# EasyEDA Pro project novadac.eprj, board PCB5
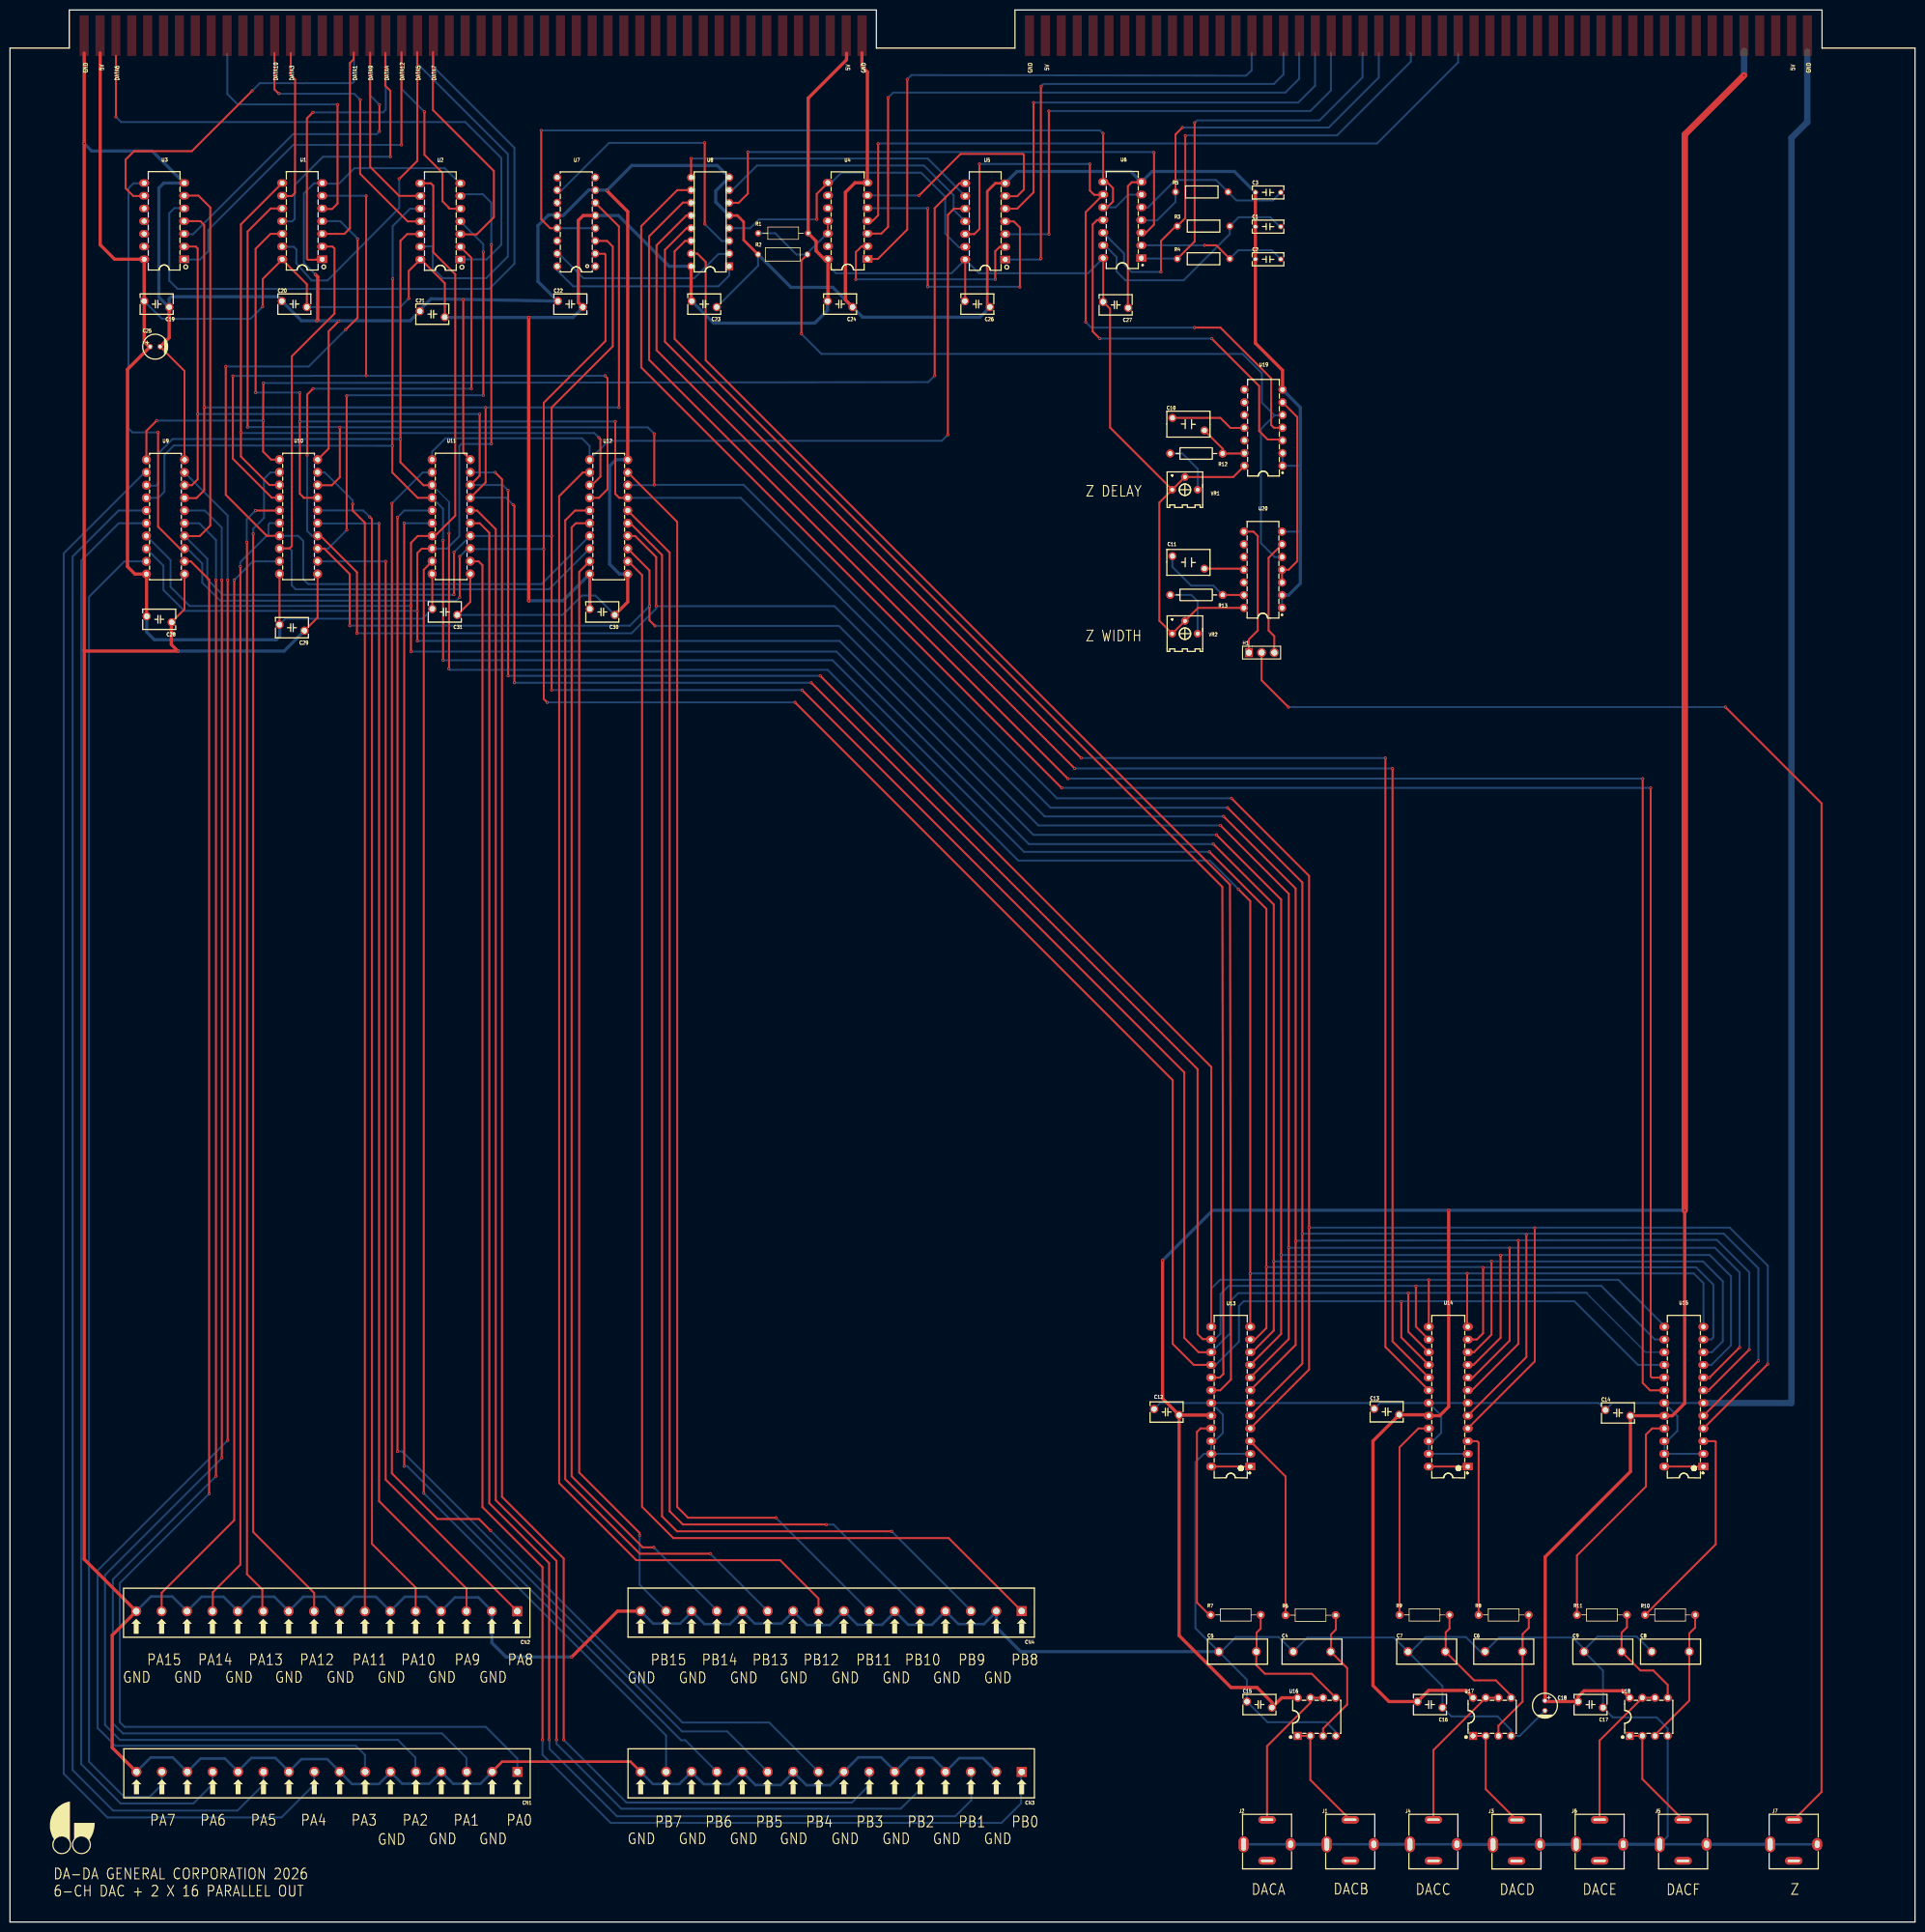
[diagram p3: board, top side]
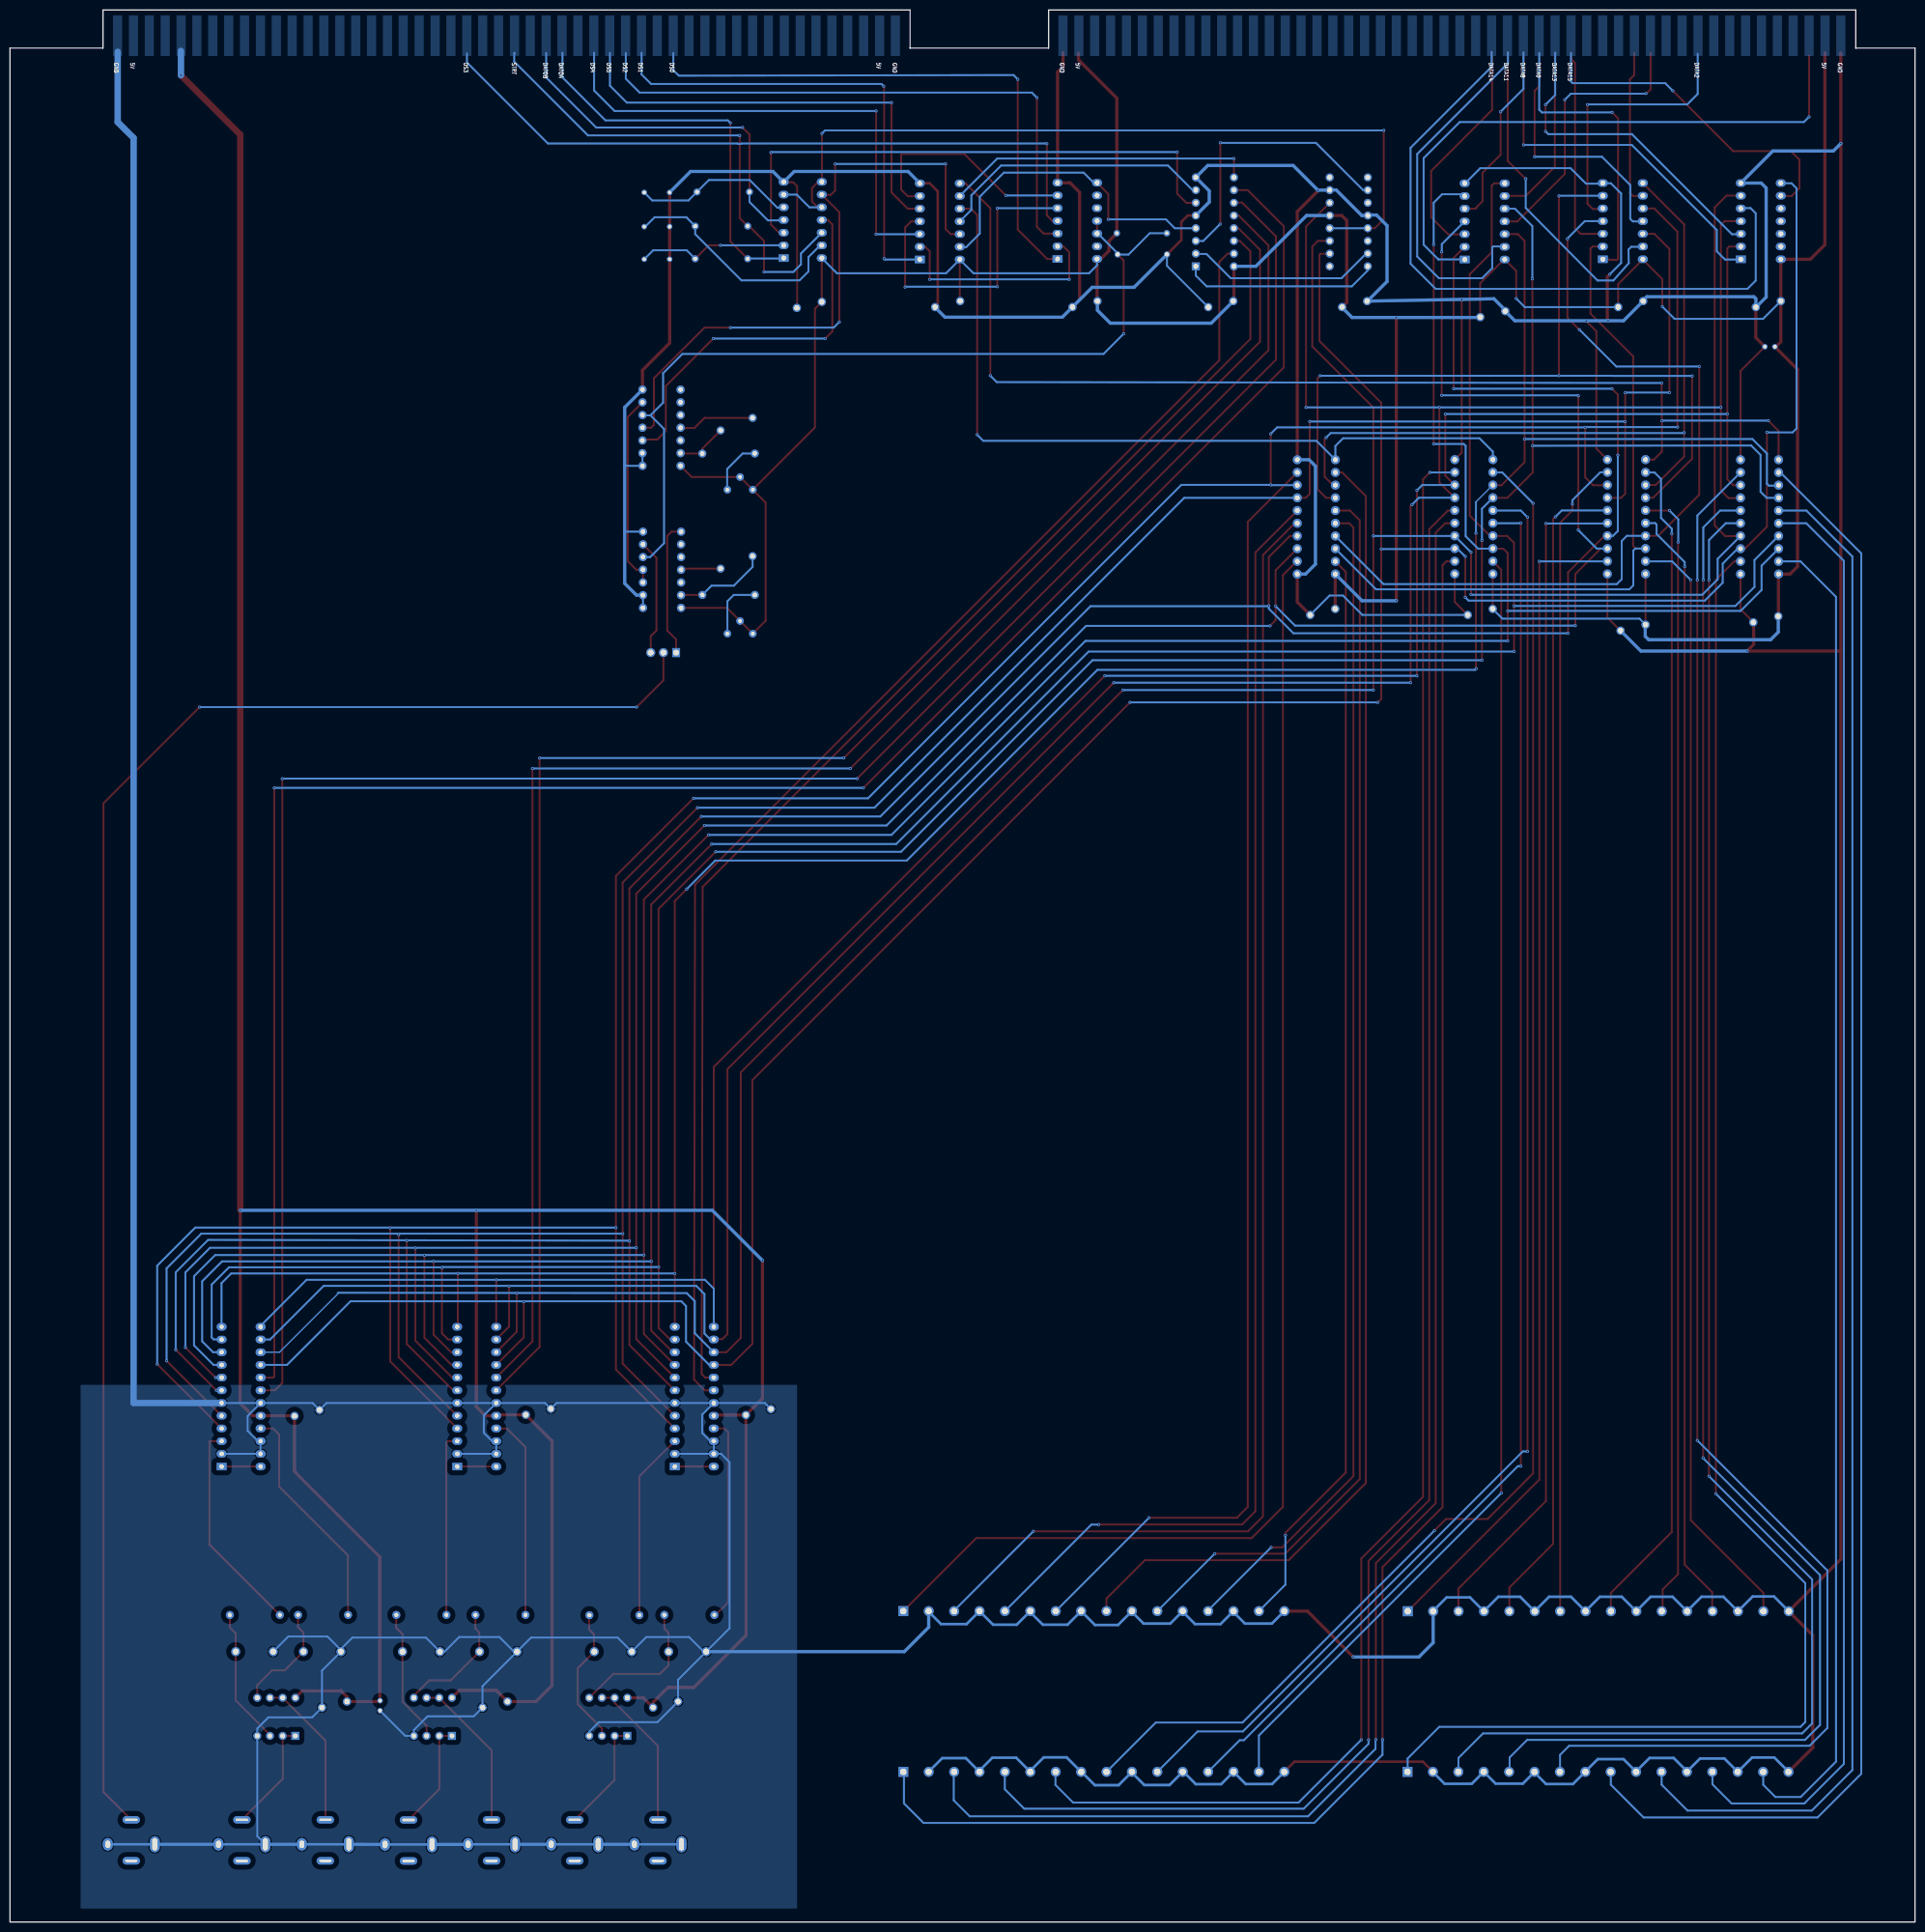
[diagram p4: board, bottom side, seen from below]

Outline 381 x 382.27 mm; copper layers: Top Layer, Bottom Layer. Coordinates in mm from the lower left corner of the outline.
Outline path: 0,374.65 11.86,374.65 11.86,382.27 173.28,382.27 173.28,374.65 200.99,374.65 200.99,382.27 362.41,382.27 362.41,374.65 381,374.65 381,0 0,0 0,374.65
Stack: Top Layer 0.035mm / Dielectric1 1.51mm FR4 er 4.5 / Bottom Layer 0.035mm

## Design rules (mm)
template: Custom Config
spacing copperThickness1oz (default): track to track 0.102, other pairs 0.152 to 0.3
spacing copperThickness2oz: track to track 0.203, other pairs 0.152 to 0.3
track width copperThickness1oz (default): min 0.127, default 0.254, max 2.54
track width copperThickness2oz: min 0.203, default 0.254, max 2.54
differential pair differentialPair (default): width min 0.127, default 0.254, max 2.54; gap min 0.152, default 0.152
via viaSize (default): diameter min 0.5, default 0.61, max 10; hole min 0.3, default 0.305, max 6.3

## Placement (name value [footprint] x y rotation side)
C1  100pF  [CAP-TH_L6.3-W2.6-P5.08-D0.5]  251.61 338.96 0 top
C2  100pF  [CAP-TH_L6.3-W2.6-P5.08-D0.5]  251.61 332.43 0 top
C3  100pF  [CAP-TH_L6.3-W2.6-P5.08-D0.5]  251.61 345.8 0 top
C4  10nF  [CAP-TH_L12.0-W5.0-P7.50-D0.6]  260.4 54.05 0 top
C5  10nF  [CAP-TH_L12.0-W5.0-P7.50-D0.6]  245.52 54.05 0 top
C6  10nF  [CAP-TH_L12.0-W5.0-P7.50-D0.6]  298.75 54.05 0 top
C7  10nF  [CAP-TH_L12.0-W5.0-P7.50-D0.6]  283.34 54.05 0 top
C8  10nF  [CAP-TH_L12.0-W5.0-P7.50-D0.6]  332.11 54.05 0 top
C9  10nF  [CAP-TH_L12.0-W5.0-P7.50-D0.6]  318.57 54.05 0 top
C10  1nF  [CAP-TH_L8.4-W5.0-P6.40-D0.8-S2.5]  235.68 299.47 0 top
C11  1nF  [CAP-TH_L8.4-W5.0-P6.40-D0.8-S2.5]  235.68 271.83 180 top
C12  100nF  [CAP-TH_L6.5-W4.0-P5.00-D0.6-S1.20]  231.32 101.96 0 top
C13  100nF  [CAP-TH_L6.5-W4.0-P5.00-D0.6-S1.20]  275.34 102.01 0 top
C14  100nF  [CAP-TH_L6.5-W4.0-P5.00-D0.6-S1.20]  321.59 101.78 0 top
C15  100nF  [CAP-TH_L6.5-W4.0-P5.00-D0.6-S1.20]  249.88 43.47 0 top
C16  100nF  [CAP-TH_L6.5-W4.0-P5.00-D0.6-S1.20]  284 43.47 180 top
C17  100nF  [CAP-TH_L6.5-W4.0-P5.00-D0.6-S1.20]  316.1 43.47 180 top
C18  10uF  [CAP-TH_BD5.0-P2.00-D0.5-FD]  306.98 43.26 270 top
C19  100nF  [CAP-TH_L6.5-W4.0-P5.00-D0.6-S1.20]  29.34 323.47 180 top
C20  100nF  [CAP-TH_L6.5-W4.0-P5.00-D0.6-S1.20]  56.87 323.47 0 top
C21  100nF  [CAP-TH_L6.5-W4.0-P5.00-D0.6-S1.20]  84.45 321.46 0 top
C22  100nF  [CAP-TH_L6.5-W4.0-P5.00-D0.6-S1.20]  112.07 323.47 0 top
C23  100nF  [CAP-TH_L6.5-W4.0-P5.00-D0.6-S1.20]  138.85 323.47 180 top
C24  100nF  [CAP-TH_L6.5-W4.0-P5.00-D0.6-S1.20]  166.01 323.47 180 top
C25  10uF  [CAP-TH_BD5.0-P2.00-D0.5-FD]  29.03 314.96 0 top
C26  100nF  [CAP-TH_L6.5-W4.0-P5.00-D0.6-S1.20]  193.47 323.47 180 top
C27  100nF  [CAP-TH_L6.5-W4.0-P5.00-D0.6-S1.20]  221.13 323.32 180 top
C28  100nF  [CAP-TH_L6.5-W4.0-P5.00-D0.6-S1.20]  29.84 260.45 180 top
C29  100nF  [CAP-TH_L6.5-W4.0-P5.00-D0.6-S1.20]  56.39 258.77 180 top
C30  100nF  [CAP-TH_L6.5-W4.0-P5.00-D0.6-S1.20]  118.45 261.92 180 top
C31  100nF  [CAP-TH_L6.5-W4.0-P5.00-D0.6-S1.20]  86.96 261.92 180 top
CN1  1701303  [CONN-TH_1701303]  63.4 30.02 180 top
CN2  1701303  [CONN-TH_1701303]  63.35 62.13 180 top
CN3  1701303  [CONN-TH_1701303]  164.24 30.02 180 top
CN4  1701303  [CONN-TH_1701303]  164.24 62.15 180 top
H1  HX PH254-01-03-Z-L11.5 pcb pin header  [HDR-TH_3P-P2.54-V-M-1]  250.32 253.8 0 top
J1  PJ-301BM  [AUDIO-TH_PJ-301BM]  268.05 16.33 0 top
J2  PJ-301BM  [AUDIO-TH_PJ-301BM]  251.41 16.33 0 top
J3  PJ-301BM  [AUDIO-TH_PJ-301BM]  301.3 16.31 0 top
J4  PJ-301BM  [AUDIO-TH_PJ-301BM]  284.68 16.33 0 top
J5  PJ-301BM  [AUDIO-TH_PJ-301BM]  334.62 16.33 0 top
J6  PJ-301BM  [AUDIO-TH_PJ-301BM]  317.93 16.33 0 top
J7  PJ-301BM  [AUDIO-TH_PJ-301BM]  356.74 16.33 0 top
R1  180Ω  [RES-TH_BD2.3-L6.0-P10.00-D0.4]  154.63 337.64 0 top
R2  470Ω  [RES-TH_BD2.5-L6.8-P10.50-D0.5]  154.54 333.4 0 top
R3  1kΩ  [RES-TH_BD2.4-L6.5-P10.50-D0.5]  238.71 339.06 0 top
R4  1kΩ  [RES-TH_BD2.4-L6.5-P10.50-D0.5]  238.71 332.53 0 top
R5  1kΩ  [RES-TH_BD2.4-L6.5-P10.50-D0.5]  238.35 345.9 0 top
R6  10kΩ  [RES-TH_BD2.3-L6.0-P10.00-D0.6]  260.12 61.34 0 top
R7  10kΩ  [RES-TH_BD2.3-L6.0-P10.00-D0.6]  245.14 61.39 0 top
R8  10kΩ  [RES-TH_BD2.3-L6.0-P10.00-D0.6]  298.73 61.39 0 top
R9  10kΩ  [RES-TH_BD2.3-L6.0-P10.00-D0.6]  282.9 61.39 0 top
R10  10kΩ  [RES-TH_BD2.3-L6.0-P10.00-D0.6]  332.03 61.39 0 top
R11  10kΩ  [RES-TH_BD2.3-L6.0-P10.00-D0.6]  318.39 61.39 0 top
R12  3.9kΩ  [RES-TH_BD2.2-L6.5-P10.50-D0.6]  237.29 293.6 180 top
R13  3.9kΩ  [RES-TH_BD2.2-L6.5-P10.50-D0.6]  237.29 265.33 180 top
U1  SN74LS04N  [PDIP-14_L19.7-W6.6-P2.54-LS8.3-BL]  58.44 340.05 90 top
U2  SN74LS04N  [PDIP-14_L19.7-W6.6-P2.54-LS8.3-BL]  86.06 340 90 top
U3  SN74LS04N  [PDIP-14_L19.7-W6.6-P2.54-LS8.3-BL]  30.84 340.05 90 top
U4  SN74LS30N  [PDIP-14_L19.6-W6.5-P2.54-LS7.9-BL]  167.53 340.11 90 top
U5  SN74LS04N  [PDIP-14_L19.7-W6.6-P2.54-LS8.3-BL]  195.04 340 90 top
U6  SN74LS08N  [PDIP-14_L19.3-W6.4-P2.54-LS7.9-BL-1]  222.45 340.29 90 top
U7  SN74LS75N  [DIP-16_L20.0-W6.4-P2.54-LS7.6-BL]  113.25 339.91 90 top
U8  SN74LS138N  [DIP-16_L19.8-W6.5-P2.54-LS7.6-BL]  140.03 339.91 90 top
U9  SN74LS374N  [PDIP-20_L25.4-W6.4-P2.54-LS7.6-BL]  31.09 280.92 90 top
U10  SN74LS374N  [PDIP-20_L25.4-W6.4-P2.54-LS7.6-BL]  57.71 280.95 90 top
U11  SN74LS374N  [PDIP-20_L25.4-W6.4-P2.54-LS7.6-BL]  88.24 280.95 90 top
U12  SN74LS374N  [PDIP-20_L25.4-W6.4-P2.54-LS7.6-BL]  119.74 280.92 90 top
U13  AD7247KNZ  [PDIP-24_L32.5-W6.5-P2.54-LS7.9-BL]  244.15 105.03 90 top
U14  AD7247KNZ  [PDIP-24_L32.5-W6.5-P2.54-LS7.9-BL]  287.65 105.03 90 top
U15  AD7247KNZ  [PDIP-24_L32.5-W6.5-P2.54-LS7.9-BL]  334.77 105.03 90 top
U16  LM6142BIN/NOPB  [PDIP-8_L9.6-W6.4-P2.54-LS7.9-BL]  261.34 41.02 0 top
U17  LM6142BIN/NOPB  [PDIP-8_L9.6-W6.4-P2.54-LS7.9-BL]  296.42 41.02 0 top
U18  LM6142BIN/NOPB  [PDIP-8_L9.6-W6.4-P2.54-LS7.9-BL]  327.74 41.02 0 top
U19  SN74LS122N  [PDIP-14_L19.2-W6.6-P2.54-LS7.6-BL]  250.7 298.75 90 top
U20  SN74LS122N  [PDIP-14_L19.2-W6.6-P2.54-LS7.6-BL]  250.6 270.36 90 top
VR1  15kΩ  [RES-ADJ-TH_3362P]  234.98 287.63 0 top
VR2  15kΩ  [RES-ADJ-TH_3362P]  234.98 258.85 0 top

## Footprints (pads in the part's own frame, mm; a bottom-side part is the same pattern mirrored in y, then rotated)
AUDIO-TH_PJ-301BM
  oval 2x3.2 hole 1x2.5: 1(-4.7,-0.8)
  oval 2x2.5 hole 1x1.5: 1(4.7,-0.8)
  oval 3.5x1.5 hole 2.5x0.5: 2(0,-4.1) 3(0,4.1)
CAP-TH_BD5.0-P2.00-D0.5-FD
  round 1.1 hole 0.7: 1(-1,0) 2(1,0)
CAP-TH_L6.3-W2.6-P5.08-D0.5
  round 1.1 hole 0.7: 1(-2.54,0) 2(2.54,0)
CAP-TH_L6.5-W4.0-P5.00-D0.6-S1.20
  round 1.65 hole 1.1: 1(-2.5,0.6) 2(2.5,-0.6)
CAP-TH_L8.4-W5.0-P6.40-D0.8-S2.5
  round 1.6 hole 1: 1(-3.2,1.25) 2(3.2,-1.25)
CAP-TH_L12.0-W5.0-P7.50-D0.6
  round 1.8 hole 1.2: 1(-3.75,0) 2(3.75,0)
CONN-TH_1701303
  rect 2x2 hole 1.3: 1(-38.1,0)
  round 2 hole 1.3: 2(-33.02,0) 3(-27.94,0) 4(-22.86,0) 5(-17.78,0) 6(-12.7,0) 7(-7.62,0) 8(-2.54,0) 9(2.54,0) 10(7.62,0) 11(12.7,0) 12(17.78,0) 13(22.86,0) 14(27.94,0) 15(33.02,0) 16(38.1,0)
DIP-16_L19.8-W6.5-P2.54-LS7.6-BL
  rect 1.6x1.6 hole 1: 1(-8.89,-3.81)
  round 1.6 hole 1: 2(-6.35,-3.81) 3(-3.81,-3.81) 4(-1.27,-3.81) 5(1.27,-3.81) 6(3.81,-3.81) 7(6.35,-3.81) 8(8.89,-3.81) 9(8.89,3.81) 10(6.35,3.81) 11(3.81,3.81) 12(1.27,3.81) 13(-1.27,3.81) 14(-3.81,3.81) 15(-6.35,3.81) 16(-8.89,3.81)
DIP-16_L20.0-W6.4-P2.54-LS7.6-BL
  round 1.6 hole 1: 1(-8.89,-3.81) 2(-6.35,-3.81) 3(-3.81,-3.81) 4(-1.27,-3.81) 5(1.27,-3.81) 6(3.81,-3.81) 7(6.35,-3.81) 8(8.89,-3.81) 9(8.89,3.81) 10(6.35,3.81) 11(3.81,3.81) 12(1.27,3.81) 13(-1.27,3.81) 14(-3.81,3.81) 15(-6.35,3.81) 16(-8.89,3.81)
HDR-TH_3P-P2.54-V-M-1
  rect 1.575x1.8 hole 1.2: 1(-2.54,0)
  round 1.8 hole 1.2: 2(0,0) 3(2.54,0)
PDIP-8_L9.6-W6.4-P2.54-LS7.9-BL
  rect 1.6x1.6 hole 1: 1(-3.81,-3.81)
  round 1.6 hole 1: 2(-1.27,-3.81) 3(1.27,-3.81) 4(3.81,-3.81) 5(3.81,3.81) 6(1.27,3.81) 7(-1.27,3.81) 8(-3.81,3.81)
PDIP-14_L19.2-W6.6-P2.54-LS7.6-BL
  round 1.65 hole 0.95: 1(-7.62,-3.81) 2(-5.08,-3.81) 3(-2.54,-3.81) 4(0,-3.81) 5(2.54,-3.81) 6(5.08,-3.81) 7(7.62,-3.81) 8(7.62,3.81) 9(5.08,3.81) 10(2.54,3.81) 11(0,3.81) 12(-2.54,3.81) 13(-5.08,3.81) 14(-7.62,3.81)
PDIP-14_L19.3-W6.4-P2.54-LS7.9-BL-1
  rect 1.5x2 hole 1: 1(-7.62,-3.809)
  oval 1.5x2 hole 1: 2(-5.08,-3.81) 3(-2.54,-3.81) 4(0,-3.81) 5(2.54,-3.81) 6(5.08,-3.81) 7(7.62,-3.81) 8(7.62,3.81) 9(5.08,3.81) 10(2.54,3.81) 11(0,3.81) 12(-2.54,3.81) 13(-5.08,3.81) 14(-7.62,3.81)
PDIP-14_L19.6-W6.5-P2.54-LS7.9-BL
  rect 1.5x2 hole 1: 1(-7.62,-3.95)
  oval 1.5x2 hole 1: 2(-5.08,-3.95) 3(-2.54,-3.95) 4(0,-3.95) 5(2.54,-3.95) 6(5.08,-3.95) 7(7.62,-3.95) 8(7.62,3.95) 9(5.08,3.95) 10(2.54,3.95) 11(0,3.95) 12(-2.54,3.95) 13(-5.08,3.95) 14(-7.62,3.95)
PDIP-14_L19.7-W6.6-P2.54-LS8.3-BL
  rect 1.5x2 hole 1: 1(-7.62,-4)
  oval 1.5x2 hole 1: 2(-5.08,-4) 3(-2.54,-4) 4(0,-4) 5(2.54,-4) 6(5.08,-4) 7(7.62,-4) 8(7.62,4) 9(5.08,4) 10(2.54,4) 11(0,4) 12(-2.54,4) 13(-5.08,4) 14(-7.62,4)
PDIP-20_L25.4-W6.4-P2.54-LS7.6-BL
  round 1.8 hole 1: 1(-11.43,-3.81) 2(-8.89,-3.81) 3(-6.35,-3.81) 4(-3.81,-3.81) 5(-1.27,-3.81) 6(1.27,-3.81) 7(3.81,-3.81) 8(6.35,-3.81) 9(8.89,-3.81) 10(11.43,-3.81) 11(11.43,3.81) 12(8.89,3.81) 13(6.35,3.81) 14(3.81,3.81) 15(1.27,3.81) 16(-1.27,3.81) 17(-3.81,3.81) 18(-6.35,3.81) 19(-8.89,3.81) 20(-11.43,3.81)
PDIP-24_L32.5-W6.5-P2.54-LS7.9-BL
  rect 1.5x2 hole 0.9: 1(-13.97,-3.9)
  oval 1.5x2 hole 0.9: 2(-11.43,-3.9) 3(-8.89,-3.9) 4(-6.35,-3.9) 5(-3.81,-3.9) 6(-1.27,-3.9) 7(1.27,-3.9) 8(3.81,-3.9) 9(6.35,-3.9) 11(11.43,-3.9)
  oval 1.524x2 hole 0.9: 10(8.89,-3.9) 12(13.97,-3.9) 13(13.97,3.9) 14(11.43,3.9) 15(8.89,3.9) 16(6.35,3.9) 17(3.81,3.9) 18(1.27,3.9) 19(-1.27,3.9) 20(-3.81,3.9) 21(-6.35,3.9) 22(-8.89,3.9) 23(-11.43,3.9) 24(-13.97,3.9)
RES-ADJ-TH_3362P
  round 1.524 hole 0.762: 1(-2.54,-1.27) 2(0,1.27) 3(2.54,-1.27)
RES-TH_BD2.2-L6.5-P10.50-D0.6
  round 1.6 hole 0.914: 1(-5.25,0) 2(5.25,0)
RES-TH_BD2.3-L6.0-P10.00-D0.4
  round 1.3 hole 0.7: 1(-5,0) 2(5,0)
RES-TH_BD2.3-L6.0-P10.00-D0.6
  round 1.6 hole 0.8: 1(-5,0) 2(5,0)
RES-TH_BD2.4-L6.5-P10.50-D0.5
  round 1.4 hole 0.8: 1(-5.25,0) 2(5.25,0)
RES-TH_BD2.5-L6.8-P10.50-D0.5
  round 1.245 hole 0.83: 1(-4.935,0) 2(4.935,0)

## Nets
As in the schematic.

Pads without a net: J1 2; J2 2; J3 2; J4 2; J5 2; J6 2; J7 2; U3 10 11 12 13; U4 9 10 13; U7 1 8 9 11 14; U19 8 9 10 12; U20 9 10 12

## Via types
v1: diameter 0.61, hole 0.305, Top Layer to Bottom Layer, 209 vias

## Routing (per net, layer and track width the routed paths; a pad name or vN(x,y) marks a point on that pad's centre or on a via; arc(x,y) is an arc through that point)
3V: length 174.7
  Top Layer w0.381: U4.12 U4.11 ; v1(158.27,317.53) 158.27,332.19 R2.2
  Bottom Layer w0.381: R1.1 153.03,337.64 157.3,333.38 159.45,333.38 ; 252.91,301.23 254.44,301.23 254.51,301.29 ; 252.91,301.23 250.38,303.76 250.38,309.65 246.52,313.51 162.3,313.51 v1(158.27,317.53) ; 252.91,301.23 250.19,298.51 250.19,275.67 252.96,272.9 U20.5 ; U4.12 163.41,337.57 159.48,333.64
GND: length 2581.8
  Top Layer w0.381: 249.01,332.5 248.95,332.43 ; C25.2 34.9,310.09 U9.10 ; U10.10 63.73,294.59 63.73,318.03 v1(65.76,320.07) ; 58.89,258.18 61.52,260.81 61.52,269.49 ; 92.05,269.49 92.05,263.92 C31.1 ; 226.26,347.83 224.36,347.83 223.57,347.04 223.57,322.87 ; U11.10 90.65,293.78 v1(90.65,324.36) ; 32.31,259.87 34.9,262.46 U9.1 ; 249.02,345.8 249.07,345.75
  Top Layer w0.508: CN3.16 124.1,32.05 98.42,32.05 96.39,30.02 ; U5.7 197.05,347.62 195.45,346.02 195.45,323.39 195.97,322.87 ; U8.5 145.46,341.18 146.74,339.9 146.74,336.27 R2.1
  Top Layer w0.635: C2.1 249.07,315.67 254.51,310.24 254.51,306.37 ; 168.51,322.87 167.08,324.3 167.08,345.82 168.99,347.73 171.48,347.73 U4.7 171.48,369.87 170.38,370.97 170.38,373.71 ; 32.27,258.96 32.27,255.41 v1(33.58,254.1) 15.05,254.1 14.83,254.31 ; U12.1 123.55,263.92 C30.1 ; 14.83,373.66 v1(14.83,355.57) 14.83,254.31 ; v1(112.34,52.98) 121.51,62.15 CN4.16 ; 25.27,30.02 20.45,34.85 20.45,57.33 CN2.16 14.83,72.54 14.83,254.31 ; 31.84,322.87 31.84,316.76 C25.2 ; 119.41,346.1 123.55,341.96 123.55,292.25 ; 249.07,332.56 C1.1 249.07,345.75 ; v1(61.06,329.41) 61.54,328.93 61.54,320.32 v1(61.37,320.14)
  Bottom Layer w0.254: U14.23 284.45,93.6 ; CN2.4 86.23,62.13
  Bottom Layer w0.381: C5.1 237.08,58.73 237.08,91.92 238.76,93.6 U13.23 ; C5.1 247.38,48.43 C15.1 251.5,39.95 263.22,39.95 265.15,38.02 265.15,37.21 ; C5.1 242.26,54.05 245.19,56.97 253.73,56.97 256.65,54.05 259.47,56.87 276.77,56.87 C7.1 ; U15.19 320.47,103.76 C14.1 317.71,103.76 U14.6 U14.19 ; U15.19 U15.6 ; U15.19 333.48,101.15 333.48,98.2 331.42,96.14 330.9,96.14 330.9,93.6 338.7,93.6 ; 62.51,347.55 65.79,347.55 68.89,350.65 86.94,350.65 89.96,347.62 90.04,347.62 ; C8.1 325.33,57.07 317.5,57.07 314.82,54.39 ; U13.23 248.04,93.6 ; U13.23 U13.22 240.92,96.14 242.57,97.79 242.57,101.43 U13.19 ; U13.19 271.68,103.76 C13.1 273.99,103.76 U14.19 ; U13.19 230.02,103.76 C12.1 ; U14.19 286.23,101.28 286.23,97.79 284.58,96.14 U14.22 U14.23 ; C7.1 286.5,47.14 C16.1 288.25,41.12 297.49,41.12 300.23,38.38 300.23,37.21 301.94,37.21 C18.2 ; C7.1 280.19,54.05 283.11,56.97 291.17,56.97 294.09,54.05 C6.1 297.82,56.87 312.52,56.87 314.82,54.58 314.82,54.39 ; J5.1 331.55,17.16 331.55,38.68 329.31,40.92 320.56,40.92 C17.1 318.6,50.26 C9.1 314.82,54.39 ; 62.44,347.62 60.81,347.62 58.78,345.59 58.78,331.7 v1(61.06,329.41) ; R2.1 149.61,331.13 141.35,322.87 ; 258.06,278.02 258.02,277.98 U20.7 ; C30.1 117.08,265.2 114.4,265.2 110.53,261.32 C31.1 ; 254.51,293.67 U19.1 258.06,291.13 258.06,291.14 ; 305.92,15.51 J3.1 ; 76.15,29.95 76.1,30 ; 284.45,93.6 U14.2 ; U20.1 U20.2
  Bottom Layer w0.508: CN4.2 197.26,62.03 194.79,59.56 189.69,59.56 CN4.4 184.38,59.44 179.65,59.44 CN4.6 176.94,61.95 174.42,59.44 169.49,59.44 CN4.8 164.01,59.38 159.38,59.38 CN4.10 156.62,62 154.28,59.66 148.95,59.66 CN4.12 146.46,62.03 143.99,59.56 138.89,59.56 CN4.14 136.3,61.95 134.01,59.66 128.63,59.66 CN4.16 ; 35.43,62.13 38.33,65.02 42.7,65.02 45.59,62.13 48.49,65.02 52.86,65.02 55.75,62.13 58.65,65.02 63.02,65.02 65.91,62.13 68.81,65.02 73.18,65.02 76.07,62.13 78.97,65.02 83.34,65.02 86.23,62.13 89,64.9 93.67,64.9 96.37,62.2 ; J4.1 289.38,15.53 ; 65.91,30.02 65.91,30.1 63.45,32.56 58.29,32.56 55.75,30.02 55.75,30.12 53.08,32.79 48.26,32.79 45.59,30.12 ; J6.1 J6.1 ; CN2.14 32.46,65.07 28.19,65.07 CN2.16 ; J7.1 J7.1 ; 96.47,29.97 96.42,29.97 94.08,27.63 88.65,27.63 86.31,29.97 ; J5.1 J5.1 ; J1.1 J1.1 ; 25.27,30.02 28.14,32.89 32.56,32.89 35.43,30.02 CN1.14 38.13,32.69 42.98,32.69 45.59,30.07 45.59,30.02 ; CN3.16 128.57,27.58 133.86,27.58 CN3.14 138.76,27.56 143.84,27.56 146.3,30.02 CN3.12 149.1,27.38 154.13,27.38 156.62,29.87 CN3.10 159.28,27.36 164.03,27.36 166.7,30.02 CN3.8 169.67,32.92 174.24,32.92 176.94,30.23 CN3.6 179.76,32.84 184.53,32.84 187.1,30.28 CN3.4 189.84,32.77 194.54,32.77 197.26,30.05 CN3.2 ; 86.26,30 86.21,30 83.87,27.66 78.44,27.66 76.15,29.95 73.79,27.58 68.4,27.58 66.01,29.97 ; J3.1 305.92,15.51 ; J2.1 J2.1
  Bottom Layer w0.635: v1(14.83,355.57) 16.33,354.08 28.44,354.08 U3.7 30.76,347.67 29.77,346.68 29.77,324.86 31.68,322.96 31.83,323.11 31.83,324.54 32.23,324.94 53.65,324.94 54.37,324.22 C20.1 58.29,320.14 v1(61.37,320.14) 80.03,320.14 C21.1 81.95,322.28 84.21,324.53 84.24,324.53 109.51,324.07 105.59,327.99 105.59,339.17 107.7,341.28 109.34,341.28 U7.12 110.65,341.18 115.77,346.3 117.02,346.3 U7.7 119.44,346.26 124.36,351.18 141.46,351.18 U8.8 141.15,346.11 141.15,343.87 U8.5 ; J5.1 J7.1 ; U20.2 255.7,265.28 258.06,267.64 258.06,302.82 254.51,306.37 ; U12.10 121.18,292.35 119.91,291.08 119.91,271.47 121.89,269.49 U12.1 ; C3.1 244.88,349.99 228.42,349.99 226.26,347.83 ; v1(33.58,254.1) 54.81,254.1 58.89,258.18 ; 289.41,15.51 296.21,15.51 ; J6.1 J5.1 ; 197.26,62.03 197.26,58.93 202.13,54.05 C5.1 ; 199.02,347.62 201.38,349.99 224.16,349.99 226.24,347.91 ; v1(112.34,52.98) 99.21,52.98 96.37,55.83 CN2.2 ; R2.1 156.19,326.82 164.56,326.82 168.51,322.87 170.53,320.85 194,320.85 195.97,322.82 195.97,322.87 ; J2.1 J1.1 ; 305.92,15.51 J6.1 ; J1.1 J4.1
  Bottom Layer w1.27: U15.6 356.29,103.76 356.29,356.69 359.46,359.87 359.46,373.91
  vias: v1(119.41,346.2)
VCC: length 729.7
  Top Layer w0.381: v1(79.76,324.59) 79.76,330.1 82.04,332.38 ; 84.46,262.52 84.46,269.46 84.43,269.49 ; C21.2 86.97,320.88 86.97,327.63 82.04,332.56 ; v1(50.54,322.97) 50.54,328.48 54.44,332.38 59.37,327.46 59.37,322.87 ; VR1.1 229.87,283.79 229.87,260.15 VR2.1 VR2.2 237.6,262.74 U20.14 ; VR1.1 VR1.2 244.65,288.9 246.89,291.13 ; VR1.1 220.01,298.79 220.01,322.53 C27.2 ; U6.14 218.64,324.14 218.57,324.07 ; U10.20 53.9,259.39 C29.2 ; U5.14 191.04,324.14 C26.2
  Top Layer w0.635: v1(103.73,264.16) 103.73,320.75 v1(103.76,320.78) ; 26.76,324.07 26.84,324.14 26.84,332.43 20.93,332.43 18.03,335.33 18.03,373.68 ; C23.2 136.22,324.2 U8.16 ; C19.2 26.84,315.94 27.81,314.96 C25.1 23.5,310.42 23.5,270.99 24.99,269.49 U9.20 27.31,269.46 27.31,260.66 ; 167.31,373.63 167.31,372.31 159.63,364.64 R1.2 161.21,336.06 161.21,334.12 162.85,332.49 U4.14 163.58,324.14 C24.2 ; U7.5 114.64,341.18 113.66,340.2 113.66,323.78 114.57,322.87 ; U12.20 115.95,269.46 115.95,262.52
  Bottom Layer w0.381: U4.14 163.58,331.23 165.18,329.64 188.3,329.64 U5.14 193.78,329.64 215.62,329.64 U6.14 ; v1(79.76,324.59) 78.04,322.87 59.37,322.87 ; C19.2 30.38,320.52 48.09,320.52 v1(50.54,322.97) ; C29.2 55.09,260.58 82.51,260.58 84.46,262.52
  Bottom Layer w0.635: C28.2 27.34,257.9 28.88,256.36 53.26,256.36 53.95,257.05 53.95,259.31 C29.2 ; U12.20 110.59,264.16 v1(103.73,264.16) ; C24.2 163.51,322.24 160.93,319.66 140.76,319.66 C23.2 ; 114.57,322.87 114.57,322.77 112.6,320.8 87.02,320.8 C21.2 ; 136.2,331.04 131.83,331.04 121.68,341.18 U7.5
VDD: length 722
  Top Layer w0.635: C12.2 233.82,57.27 244.2,46.89 249.4,46.89 252.38,43.91 C15.2 254.34,44.83 U16.8 ; C12.2 230.5,104.67 v1(230.5,132.26) ; C12.2 240.11,101.36 U13.20 ; v1(287.73,142.29) 287.73,103.02 285.93,101.22 U14.20 283.57,101.41 C13.2 272.59,96.16 272.59,47.27 275.79,44.07 C16.2 283.73,46.3 291.13,46.3 U17.8 ; U18.8 322.53,46.23 314.81,46.23 313.6,45.02 C17.2 307.17,44.07 C18.1 307.04,44.31 307.04,73 324.09,90.05 C14.2 324.13,101.22 332.46,101.22 334.95,103.71 v1(334.95,142.29)
  Top Layer w1.27: v1(346.81,369.21) 334.95,357.35 v1(334.95,142.29)
  Bottom Layer w0.635: v1(230.5,132.26) 240.54,142.29 v1(287.73,142.29) v1(334.95,142.29)
  Bottom Layer w1.27: 346.82,369.22 346.82,374.1
COMSEL: length 127.2
  Top Layer w0.381: v1(193.88,351.48) 193.88,338.48 192.86,337.46 U5.12 ; 218.59,345.31 U6.9 ; 218.59,345.31 215.14,341.86 v1(215.14,319.89) ; 218.59,345.31 216.84,345.31 215.98,346.18 v1(215.98,351.48) ; v1(236.91,318.77) 242.09,318.77 252.22,308.64 252.22,299.31 252.78,298.75 U19.4
  Bottom Layer w0.381: v1(215.14,319.89) 216.26,318.77 v1(236.91,318.77) ; v1(193.88,351.48) v1(215.98,351.48)
D0: length 607.2
  Top Layer w0.381: v1(29.62,297.84) 29.62,278.97 34.01,274.57 U9.3 ; U13.16 236.75,111.38 232.54,115.6 232.54,168.3 v1(157,243.84) ; v1(89.94,264.85) v1(89.94,273) ; U14.16 278.26,116.88 v1(278.26,124.03) ; 117.06,333.53 118.92,333.53 119.1,333.36 119.1,316.1 106.76,303.76 v1(106.76,274.5) 106.76,244.53 v1(107.44,243.84)
  Bottom Layer w0.381: 26.84,347.62 24.69,347.62 23.7,346.63 23.7,298.6 24.49,297.81 29.59,297.81 v1(29.62,297.84) ; 34.92,274.57 35.46,274.57 38.46,271.58 38.46,267.77 42.04,264.19 89.28,264.19 v1(89.94,264.85) ; U13.16 241.15,111.38 245.8,116.03 245.8,123.16 246.74,124.1 312.88,124.1 325.6,111.38 330.9,111.38 ; v1(106.76,274.5) 92.13,274.5 92.05,274.57 91.51,274.57 v1(89.94,273) ; v1(157,243.84) v1(107.44,243.84)
D1: length 600
  Top Layer w0.381: v1(279.65,125.73) 279.65,118.02 U14.15 ; U9.4 34.92,277.09 37.95,277.09 40.06,279.2 40.06,342.8 37.69,345.16 34.51,345.16 ; v1(108.33,246.3) v1(108.33,277.11) 108.33,302.79 120.55,315.01 120.55,334.97 119.42,336.1 U7.3 ; U13.15 237.72,113.92 234.85,116.79 234.85,169.87 v1(158.42,246.3) ; v1(88.8,265.4) v1(88.8,273.86)
  Bottom Layer w0.254: 330.57,113.92 327.1,113.92 315.21,125.81 315.54,125.81
  Bottom Layer w0.381: v1(158.42,246.3) v1(108.33,246.3) ; U9.4 39.47,272.54 39.47,268.43 42.55,265.35 88.75,265.35 v1(88.8,265.4) ; v1(108.33,277.11) 92.05,277.11 v1(88.8,273.86) ; 315.21,125.81 245.65,125.73 244.04,124.13 244.04,117.72 U13.15
D2: length 592.7
  Top Layer w0.381: v1(95.12,302.79) 95.12,287.81 92.05,284.73 ; U14.14 281.18,119.04 v1(281.18,127.13) ; v1(121.79,302.82) 121.79,338.99 U7.6 ; U13.14 240.17,116.53 238.53,116.53 237.51,117.55 237.51,170.51 v1(160.25,247.78) ; U3.4 38.07,340.05 38.84,339.29 v1(38.84,302.82) 38.84,286.23 37.29,284.68 34.95,284.68 U9.7 ; v1(100.89,247.78) 100.87,247.79 100.87,283.1 v1(100.61,283.36)
  Bottom Layer w0.381: v1(160.25,247.78) v1(100.89,247.78) ; v1(100.61,283.36) 99.21,284.76 U11.7 ; U13.14 240.92,116.46 242.11,117.65 242.11,125.55 243.74,127.18 318.26,127.18 328.98,116.46 330.9,116.46 ; v1(38.84,302.82) 95.1,302.82 v1(95.12,302.79) 95.15,302.82 v1(121.79,302.82)
D3: length 506
  Top Layer w0.381: v1(99.62,249.15) v1(99.62,286.23) ; v1(162.05,249.15) 240.25,170.96 U13.13 ; 92.05,287.27 93.93,289.15 v1(93.93,301.47) ; U9.8 34.91,287.26 36.36,287.26 37.54,288.44 v1(37.54,301.49) 37.54,334.59 37.16,334.97 U3.2 ; v1(283.74,128.37) 283.75,128.36 U14.13
  Bottom Layer w0.254: v1(283.74,128.37) 283.74,128.39 283.75,128.4
  Bottom Layer w0.381: U11.8 98.55,287.3 v1(99.62,286.23) ; 330.9,119 330.9,119.18 321.68,128.4 242.01,128.4 240.25,126.63 U13.13 ; v1(162.05,249.15) v1(99.62,249.15) ; v1(37.54,301.49) 93.91,301.49 v1(93.93,301.47)
D4: length 529
  Top Layer w0.381: v1(87.81,277.65) 87.81,250.62 v1(87.76,250.57) ; 82.04,337.46 79.43,337.46 78.09,336.12 v1(78.09,296.48) 78.09,291.86 82.7,287.25 84.35,287.28 ; v1(291.44,129.67) 291.44,119.12 U14.12 ; 84.43,287.27 84.39,287.24 ; v1(245.67,206.5) 248.04,204.13 v1(248.04,129.63) 248.04,119
  Bottom Layer w0.254: 87.81,283.92 U11.13
  Bottom Layer w0.381: v1(87.76,250.57) 87.99,250.34 163.53,250.34 201.65,212.22 239.95,212.22 v1(245.67,206.5) ; 338.7,119 338.7,127.72 336.75,129.67 v1(291.44,129.67) 248.08,129.67 v1(248.04,129.63) ; v1(87.81,277.65) 87.81,283.92 ; v1(78.09,296.48) 78.07,296.49 32.51,296.49 29.62,293.6 29.62,287.55 29.24,287.17 27.38,287.17 U9.13 ; 84.43,287.29 84.43,287.27
D5: length 551.2
  Top Layer w0.254: v1(86.61,276.22) 86.49,276.1
  Top Layer w0.381: U14.11 293.37,116.46 294.61,117.7 294.61,130.81 v1(294.64,130.84) ; 248.04,116.46 248.97,116.46 251.28,118.77 v1(251.28,130.94) 251.28,202.56 v1(239.88,213.97) ; v1(86.61,276.22) 86.61,252.3 v1(86.59,252.27) ; 84.43,284.73 81.53,284.73 76.46,289.81 v1(76.47,295.14) v1(76.53,328.52)
  Bottom Layer w0.381: 84.43,284.73 86.61,282.55 v1(86.61,276.22) ; v1(76.47,295.14) 32.77,295.2 30.89,293.32 30.89,285.95 29.67,284.73 U9.14 ; v1(76.53,328.52) 76.53,339.06 80.01,342.54 82.04,342.54 ; v1(251.28,130.94) 294.54,130.94 v1(294.64,130.84) 294.69,130.89 337.21,130.89 340.67,127.43 340.67,116.87 340.28,116.48 338.72,116.48 338.7,116.46 ; v1(239.88,213.97) 202.79,213.97 164.49,252.27 v1(86.59,252.27)
D6: length 579.6
  Top Layer w0.381: v1(80.19,254) v1(80.19,263.14) 80.2,263.16 80.2,275.76 81.56,277.11 84.43,277.11 ; 82.04,347.62 84.18,347.62 84.66,347.14 84.66,333.83 89.05,329.44 89.05,281.17 84.97,277.09 84.43,277.09 ; v1(296.29,132.11) 296.29,117.42 292.79,113.92 U14.10 ; 248.04,113.92 248.44,113.92 252.76,118.24 v1(252.76,132.08) 252.76,203.43 v1(240.66,215.52)
  Bottom Layer w0.381: v1(80.19,254) 165.28,254 203.76,215.52 v1(240.66,215.52) ; U9.17 32.11,272.29 32.11,266.93 35.92,263.12 80.16,263.12 v1(80.19,263.14) ; 338.7,113.92 340.39,113.92 342.57,116.1 342.57,128.09 338.58,132.08 v1(252.76,132.08)
D7: length 597.2
  Top Layer w0.381: v1(241.3,217.35) 254.23,204.42 v1(254.23,133.35) 254.23,117.56 248.04,111.38 ; v1(298.12,133.3) 298.12,116.81 292.68,111.38 U14.9 ; 84.43,274.57 82.35,274.57 81.46,273.69 v1(81.46,262.13) v1(81.46,256.13) ; v1(96.27,335.36) v1(96.27,295.5)
  Bottom Layer w0.381: U9.18 30.68,271.17 30.68,266.32 34.87,262.13 v1(81.46,262.13) ; v1(96.27,295.5) 90.25,295.5 89.87,295.12 89.87,277.06 87.38,274.57 84.43,274.57 ; v1(96.27,335.36) 96.27,343.74 94.56,345.44 90.4,345.44 90.04,345.08 ; v1(254.23,133.35) 339.95,133.35 344.2,129.11 344.2,115.29 340.28,111.38 338.7,111.38 ; v1(241.3,217.35) 204.7,217.35 165.91,256.13 v1(81.46,256.13)
D8: length 592.2
  Top Layer w0.381: U14.8 292.53,108.84 299.92,116.23 v1(299.92,134.75) ; 248.04,108.84 255.75,116.55 v1(255.75,134.8) 255.75,205.59 v1(242.11,219.23) ; U12.3 127.89,270.23 v1(127.89,263.09) 127.89,260.25 v1(129.01,259.13) ; v1(67.94,259.18) 67.94,269.49 62.86,274.57 61.52,274.57 ; v1(67.36,278.31) 67.34,278.33 v1(67.34,305.13) ; v1(94.67,333.91) v1(94.67,305.23) ; v1(339.88,108.84) v1(345.92,114.88)
  Bottom Layer w0.381: v1(94.67,305.23) 67.44,305.23 v1(67.34,305.13) ; 90.04,340 90.09,340 94.64,335.45 94.64,333.93 v1(94.67,333.91) ; v1(255.75,134.8) 341,134.8 345.92,129.87 v1(345.92,114.88) ; U10.3 63.65,274.6 v1(67.36,278.31) ; v1(127.89,263.09) 123.98,259.18 v1(67.94,259.18) ; v1(242.11,219.23) 205.69,219.23 165.79,259.13 v1(129.01,259.13) ; 338.7,108.84 v1(339.88,108.84)
D9: length 606.6
  Top Layer w0.381: U12.4 125.02,277.11 129.24,272.9 v1(129.24,263.14) ; v1(59.44,293.27) 59.44,305.38 v1(60.6,306.55) ; U14.7 292.38,106.3 301.65,115.57 v1(301.65,136.25) ; v1(92.28,306.55) 92.28,332.71 U2.2 ; 248.04,106.3 257.12,115.38 v1(257.12,136.12) 257.12,206.63 v1(242.72,221.03) ; v1(339.73,106.3) v1(347.85,114.43) ; 61.52,277.11 62.13,277.11 69.39,269.85 v1(69.39,257.66)
  Bottom Layer w0.381: v1(257.12,136.12) 257.12,136.22 341.38,136.37 347.85,129.9 v1(347.85,114.43) ; v1(69.39,257.66) 124.31,257.66 129.24,262.58 v1(129.24,263.14) 129.31,263.07 164.9,263.07 206.93,221.03 v1(242.72,221.03) ; v1(59.44,293.27) 59.44,278.1 60.4,277.14 U10.4 ; v1(92.28,306.55) v1(60.6,306.55) ; 338.7,106.3 v1(339.73,106.3)
D10: length 595.4
  Top Layer w0.381: 61.52,284.73 58.78,284.73 57.96,285.55 57.96,305.71 ; U14.5 303.28,112.94 v1(303.28,137.44) ; 338.7,101.22 v1(349.68,112.2) ; v1(49.12,305.79) 49.12,334.52 52.12,337.51 U1.12 ; U12.7 121.84,284.73 121.06,285.52 v1(121.06,300) ; 248.04,101.22 258.47,111.64 v1(258.47,137.62) 258.47,207.82 v1(243.51,222.78)
  Bottom Layer w0.381: U12.7 146.15,284.73 208.1,222.78 v1(243.51,222.78) ; v1(258.47,137.62) 342.75,137.62 349.68,130.68 v1(349.68,112.2) ; v1(121.06,300) 58.01,300 v1(57.99,299.97) ; v1(57.96,305.76) 57.94,305.79 v1(49.12,305.79)
D11: length 617.6
  Top Layer w0.381: 338.7,98.68 v1(351.56,111.54) ; U14.4 304.95,112.08 v1(304.95,138.76) ; 248.04,98.68 259.82,110.45 v1(259.82,138.84) 259.82,209.14 v1(244.3,224.66) ; 61.52,287.27 61.54,287.25 64.36,287.25 65.96,288.85 v1(65.96,298.83) ; U1.10 52.15,342.59 47.52,337.97 47.52,298.91 v1(47.5,298.88) ; v1(128.85,287.32) v1(128.85,297.54)
  Bottom Layer w0.381: v1(244.3,224.66) 209.4,224.66 146.74,287.32 v1(128.85,287.32) 128.8,287.27 U12.8 ; v1(351.56,111.54) 351.56,131.22 343.94,138.84 v1(259.82,138.84) ; v1(128.85,297.54) 127.56,298.83 v1(65.96,298.83) 65.91,298.88 v1(47.5,298.88)
D12: length 151
  Top Layer w0.381: 53.9,287.27 53.87,287.3 51.87,287.3 46.18,292.99 v1(46.18,297.77) 46.18,339.41 U1.8 ; v1(117.78,296.77) 118.08,296.47 118.08,288.98 116.38,287.27 U12.13
  Bottom Layer w0.381: v1(46.18,297.77) 46.26,297.69 116.87,297.69 v1(117.78,296.77)
D13: length 175.5
  Top Layer w0.381: v1(44.58,309.09) 44.58,292.56 52.38,284.76 53.87,284.76 53.9,284.73 ; v1(71.22,309.17) v1(71.22,345.08) ; v1(119,309.14) 119.51,308.64 119.51,286.46 117.78,284.73 U12.14
  Bottom Layer w0.381: v1(119,309.14) 60.4,309.14 60.38,309.12 44.6,309.12 v1(44.58,309.09) ; v1(71.22,345.08) 71.17,345.13 U1.6
D14: length 169
  Top Layer w0.381: v1(69.52,336.5) 69.52,320.75 v1(67.13,318.36) ; 53.9,277.11 53.87,277.14 51.36,277.14 43.15,285.34 v1(43.15,311)
  Bottom Layer w0.381: U1.4 66.04,340.05 69.52,336.58 ; v1(43.15,311) 59.74,311 67.13,318.39 ; U10.17 57.63,277.14 58.65,276.12 58.65,268.48 59.64,267.49 106.3,267.49 U12.17
D15: length 141.2
  Top Layer w0.381: U1.2 64.52,334.97 64.9,334.59 64.9,321.56 56.36,313.03 56.36,275.08 55.93,274.65 53.98,274.65 53.9,274.57
  Bottom Layer w0.381: U12.18 107.8,266.45 57.12,266.45 56.34,267.23 56.34,274.19 55.93,274.6 U10.18
DACAWR: length 275.3
  Top Layer w0.381: U13.18 242.04,106.3 244.2,108.46 243.99,207.39 139.14,312.24 139.14,331.9 137.48,333.56 U8.15
DACBWR: length 276.7
  Top Layer w0.381: U13.17 241.94,108.84 242.67,109.58 242.47,206.96 132.92,316.51 132.92,334.01 135.01,336.1 U8.14
DACCWR: length 334
  Top Layer w0.381: U8.13 135.31,338.64 130.99,334.31 130.99,315.95 214.21,232.73 v1(214.24,232.73) ; v1(275.08,232.71) 275.08,114.97 U14.18
  Bottom Layer w0.381: v1(214.24,232.73) 214.25,232.71 v1(275.08,232.71)
DACDWR: length 337
  Top Layer w0.381: U14.17 276.5,116.09 v1(276.5,230.61) ; v1(212.93,230.63) 129.31,314.25 129.31,335.23 135.26,341.18 U8.12
  Bottom Layer w0.381: v1(276.5,230.61) 276.48,230.63 v1(212.93,230.63)
DACEWR: length 395.1
  Top Layer w0.381: 136.22,343.77 134.58,343.77 127.81,337.01 127.81,312.34 211.56,228.6 v1(211.58,228.6) ; v1(326.54,228.57) 326.54,107.77 328.02,106.3 330.9,106.3
  Bottom Layer w0.381: v1(326.54,228.57) 326.52,228.6 v1(211.58,228.6)
DACFWR: length 398.4
  Top Layer w0.381: 330.9,108.84 328.4,108.84 328.14,109.09 v1(328.14,226.75) ; v1(210.35,226.75) 210.31,226.75 126.24,310.82 126.24,339.04 133.46,346.26 U8.10
  Bottom Layer w0.381: v1(210.35,226.75) v1(328.14,226.75)
DATA0: length 59.1
  Top Layer w0.381: v1(60.58,361.8) 59.39,360.6 59.39,332.51 59.56,332.33 61.11,332.33 61.17,332.38 62.44,332.38
  Bottom Layer w0.381: v1(60.58,361.8) 74.62,361.8 75.16,362.33 75.16,373.68
DATA1: length 41.5
  Top Layer w0.381: 62.44,337.46 62.49,337.51 66.88,337.51 68,338.63 68,371.69 68.73,372.43 68.73,373.79
DATA2: length 54.3
  Top Layer w0.381: v1(65.51,363.35) 65.51,343.56 64.44,342.49 62.49,342.49 62.44,342.54
  Bottom Layer w0.381: 43.46,373.53 43.46,365.48 45.54,363.4 65.46,363.4 v1(65.51,363.35)
DATA3: length 31.1
  Top Layer w0.381: 54.44,345.08 56.39,345.08 57,345.69 57.02,368.41 56.16,369.26 56.16,373.66
DATA4: length 52.1
  Top Layer w0.381: v1(76.07,352.93) 76.07,366.12 75.06,367.13 75.06,373.68
  Bottom Layer w0.381: 54.44,340 56.44,340 56.95,340.51 56.95,347.27 62.61,352.93 v1(76.07,352.93)
DATA5: length 66.6
  Top Layer w0.381: v1(77.84,348.53) 77.88,348.53 81.46,352.1 81.46,373.79
  Bottom Layer w0.381: v1(77.84,348.53) 77.85,348.51 77.85,342.7 63.5,328.19 60.33,328.19 57.25,331.65 57.3,334.37 56.74,334.92 54.44,334.92
DATA6: length 119.5
  Top Layer w0.381: 21.19,373.12 21.19,360.91 v1(21.18,360.91)
  Bottom Layer w0.381: v1(21.18,360.91) 22.23,359.87 91.06,359.87 98.27,352.65 98.27,335.36 95.3,332.38 95.28,332.41 90.06,332.41 90.04,332.38
DATA7: length 46.2
  Top Layer w0.381: 90.04,337.46 90.09,337.41 93.34,337.41 96.77,340.84 96.77,350.09 84.58,362.28 84.58,373.84
DATA8: length 37.3
  Top Layer w0.381: 90.04,342.54 87.91,342.54 87.73,342.72 87.73,342.8 86.49,344.04 86.49,349.73 82.88,353.34 v1(82.88,361.92)
  Bottom Layer w0.381: 78.31,373.79 78.31,366.5 v1(82.88,361.92)
DATA9: length 35.2
  Top Layer w0.381: 82.04,345.08 82.01,345.11 77.83,345.11 72.03,350.9 72.03,373.74
DATA10: length 56.1
  Top Layer w0.381: v1(70.05,364.31) 70.03,364.29 70.03,349.5 79.53,340 82.04,340 ; 52.88,373.68 52.88,366.39 53.7,365.58 v1(53.8,365.58)
  Bottom Layer w0.381: v1(70.05,364.31) 68.83,365.53 53.85,365.53 v1(53.8,365.58)
DATA11: length 72.8
  Bottom Layer w0.381: 81.41,373.81 81.41,371.63 99.57,353.47 99.57,332.99 95.22,328.65 86.56,328.65 84.56,330.66 84.56,334.82 84.38,335 82.04,335 81.96,334.92
DATA12: length 74
  Top Layer w0.381: 78.28,373.84 v1(78.28,355.29)
  Bottom Layer w0.381: v1(78.28,355.29) 56.64,355.29 39.65,338.3 39.65,334.04 38,332.38 34.84,332.38
DATA13: length 64.1
  Top Layer w0.381: v1(73.89,363.35) v1(73.89,358.01)
  Bottom Layer w0.381: v1(73.89,363.35) 71.96,365.28 71.96,373.76 ; 34.84,337.46 34.86,337.44 36.6,337.44 56.62,357.45 73.33,357.45 v1(73.89,358.01)
DATA14: length 137.9
  Bottom Layer w0.381: 34.84,342.54 34.71,342.67 32.89,342.67 31.85,341.63 31.85,328.17 33.5,326.52 95.86,326.52 100.89,331.55 100.89,354.71 84.58,371.02 84.58,371.27 84.68,371.37 84.68,373.89
DATA15: length 67.9
  Top Layer w0.381: 26.84,345.08 24.66,345.08 23.11,346.63 23.11,352.35 24.82,354.05 36.37,354.05 v1(48.42,366.1)
  Bottom Layer w0.381: v1(48.42,366.1) 49.96,367.64 68.48,367.64 68.81,367.97 68.81,373.66
DATOA: length 78.1
  Top Layer w0.381: R4.1 236.93,336.01 v1(236.93,359.71)
  Bottom Layer w0.381: v1(236.93,359.71) 237.41,360.2 261.9,360.2 270.51,368.81 270.51,373.74 ; 226.26,332.59 233.4,332.59 R4.1
DATOB: length 72.1
  Top Layer w0.381: R5.1 233.1,357.39 v1(234.49,358.77)
  Bottom Layer w0.381: 273.76,373.68 273.76,368.78 263.75,358.77 v1(234.49,358.77) ; 226.26,340.21 229.42,340.21 233.1,343.9 R5.1
DS0: length 113.6
  Top Layer w0.381: U4.1 173.56,332.49 179.45,338.38 v1(179.45,368.4)
  Bottom Layer w0.381: 248.34,373.68 248.34,370.2 247.22,369.14 180.29,369.26 179.43,368.4
DS1: length 95.5
  Top Layer w0.381: v1(206.25,367.03) 206.17,366.95 v1(206.17,332.56)
  Bottom Layer w0.381: U5.1 205.99,332.38 v1(206.17,332.56) ; v1(206.25,367.03) 206.71,367.49 252.78,367.49 254.69,369.39 254.69,373.74
DS2: length 119.5
  Top Layer w0.381: v1(175.62,364.74) 175.62,338.91 174.27,337.57 U4.3
  Bottom Layer w0.381: 257.84,373.68 257.84,368.53 255.07,365.76 176.63,365.76 v1(175.62,364.74)
DS3: length 141.5
  Top Layer w0.381: U4.4 172.52,340.11 173.63,341.22 v1(173.63,355.52)
  Bottom Layer w0.381: 289.61,373.58 289.61,371.78 273.42,355.59 235.47,355.59 235.37,355.49 234.83,355.49 234.73,355.59 173.7,355.59 v1(173.63,355.52)
DS4: length 99.1
  Top Layer w0.381: v1(207.8,337.44) 207.77,337.46 v1(207.77,362.08)
  Bottom Layer w0.381: 264.19,373.74 264.19,366.19 260.07,362.08 v1(207.77,362.08) ; U5.3 199.07,337.44 v1(207.8,337.44)
DS5: length 89.2
  Top Layer w0.381: v1(204.7,363.75) 204.7,345.8 201.45,342.54 U5.5
  Bottom Layer w0.381: 261.01,373.68 261.01,367.13 257.63,363.75 v1(204.7,363.75)
PA0: length 327.5
  Top Layer w0.381: v1(39.83,85.62) 39.83,268.38 36.17,272.03 U9.2
  Bottom Layer w0.381: v1(39.83,85.62) 21.95,67.74 21.95,39.98 22.91,39.01 95.15,39.01 101.47,32.69 101.47,30.02
PA1: length 329.2
  Top Layer w0.381: v1(41.2,268.3) v1(41.2,89.13)
  Bottom Layer w0.381: U9.5 37.85,279.65 41.2,276.3 v1(41.2,268.3) ; v1(41.2,89.13) 20.57,68.5 20.57,39.7 22.57,37.71 86.4,37.71 91.31,32.79 91.31,30.02
PA2: length 325.6
  Top Layer w0.381: v1(42.37,92.79) 42.37,268.27 v1(42.34,268.3)
  Bottom Layer w0.381: 81.15,30.02 81.08,30.1 81.08,32.89 77.56,36.41 21.98,36.41 19,39.4 19,69.37 42.37,92.74 v1(42.37,92.79) ; U9.6 38.96,282.19 42.34,278.82 v1(42.34,268.3)
PA3: length 324.5
  Top Layer w0.381: v1(43.54,268.3) v1(43.54,96.29)
  Bottom Layer w0.381: v1(43.54,268.3) 43.54,281.18 U9.9 ; 70.99,30.02 70.99,33.4 69.16,35.23 21.08,35.23 17.53,38.79 17.53,70.28 v1(43.54,96.29)
PA4: length 326.2
  Bottom Layer w0.381: U9.12 26.92,289.81 10.74,273.63 10.74,29.64 19.48,20.9 54.28,20.9 60.83,27.46 60.83,30.02
PA5: length 307.4
  Bottom Layer w0.381: 50.67,30.02 50.67,27.46 45.49,22.28 20.62,22.28 12.52,30.38 12.52,273 21.72,282.19 U9.15
PA6: length 290.3
  Bottom Layer w0.381: 40.51,30.02 40.51,27.53 36.68,23.7 22.12,23.7 14.22,31.6 14.22,272.14 21.74,279.65 U9.16
PA7: length 268.4
  Bottom Layer w0.381: 30.35,30.02 30.35,27.43 27.91,24.99 22.86,24.99 15.8,32.05 15.8,264.95 22.89,272.03 U9.19
PA8: length 234.4
  Top Layer w0.381: CN2.1 75.13,88.44 v1(75.13,272.03)
  Bottom Layer w0.381: 61.52,272.03 v1(75.13,272.03)
PA9: length 237
  Top Layer w0.381: v1(73.81,279.6) 73.81,84.15 91.31,66.65 91.31,62.15 CN2.3
  Bottom Layer w0.381: v1(73.81,279.6) 61.57,279.6 61.52,279.65
PA10: length 233.6
  Top Layer w0.381: v1(71.93,280.92) 72.39,280.47 72.39,75.59 81.13,66.85 CN2.5
  Bottom Layer w0.381: v1(71.93,280.92) 70.64,282.22 U10.6
PA11: length 232.5
  Top Layer w0.381: CN2.7 70.97,279.76 68.53,282.19 v1(68.53,283.49)
  Bottom Layer w0.381: v1(68.53,283.49) 68.53,284.25 62.94,289.84 U10.9
PA12: length 235.9
  Top Layer w0.381: v1(48.64,277.55) 48.64,77.98 60.83,65.79 60.83,62.15
  Bottom Layer w0.381: v1(48.64,277.55) 48.64,278.56 50.8,280.72 50.8,288.52 52.1,289.81 53.9,289.81
PA13: length 227
  Top Layer w0.381: v1(47.37,275.87) 47.37,275.82 47.4,275.79 47.4,69.54 50.47,66.47 50.47,62.31 CN2.11 ; 53.9,282.19 v1(49.1,282.19)
  Bottom Layer w0.381: v1(47.37,275.87) 47.35,275.89 47.35,280.44 v1(49.1,282.19)
PA14: length 224.2
  Top Layer w0.381: 46.08,270.94 46.08,71.45 40.56,65.94 40.56,62.2 CN2.13
  Bottom Layer w0.381: U10.16 51.96,279.68 51.69,279.41 51.69,277.52 46.06,271.89 v1(46.06,271.01)
PA15: length 222.8
  Top Layer w0.381: 44.86,268.35 44.85,268.34 44.85,80.33 30.33,65.81 30.33,62.15
  Bottom Layer w0.381: v1(44.86,268.33) 48.56,272.03 53.9,272.03
PAWR: length 224.1
  Top Layer w0.381: v1(29.34,300.18) 27.28,298.12 U9.11 ; v1(184.94,309.17) 184.94,342.65 189.92,347.62 U5.8 ; U10.11 52.22,292.38 50.62,293.98 v1(50.62,300.13) v1(50.67,307.7)
  Bottom Layer w0.381: v1(50.67,307.7) 183.64,307.87 v1(184.94,309.17) ; v1(50.62,300.13) 50.57,300.18 v1(29.34,300.18)
PB0: length 354.9
  Top Layer w0.381: 92.05,272.03 93.73,272.03 94.49,271.27 94.49,82.96 106.5,70.94 v1(106.5,36.45)
  Bottom Layer w0.381: v1(106.5,36.45) 106.5,33.45 120.14,19.81 198.3,19.81 202.21,23.72 202.21,29.9 CN3.1
PB1: length 349.7
  Top Layer w0.381: 92.05,279.65 93.95,279.65 95.86,277.75 95.86,83.72 107.82,71.75 v1(107.82,36.45)
  Bottom Layer w0.381: v1(107.82,36.45) 107.9,36.37 107.9,34.62 121.39,21.13 189.05,21.13 192.25,24.33 192.25,29.95 CN3.3
PB2: length 337.7
  Top Layer w0.381: 92.05,282.19 93.42,282.19 97.16,278.46 97.16,84.33 109.3,72.19 v1(109.3,36.42)
  Bottom Layer w0.381: v1(109.3,36.42) 109.3,35.61 122.25,22.66 178.16,22.66 182.04,26.54 182.04,30 CN3.5
PB3: length 334.5
  Top Layer w0.381: v1(97.03,289.81) 98.4,288.44 98.4,85.01 110.74,72.67 v1(110.74,36.42)
  Bottom Layer w0.381: CN3.7 171.91,29.97 171.91,27.41 168.38,23.88 123.29,23.88 v1(110.74,36.42) ; 92.05,289.81 v1(97.03,289.81)
PB4: length 314.6
  Top Layer w0.381: v1(96.11,78.26) 93.8,80.57 85.5,80.57 76.38,89.69 v1(76.38,283.64)
  Bottom Layer w0.381: v1(76.38,283.64) 82.55,289.81 84.43,289.81 ; CN3.9 151.84,39.88 134.49,39.88 v1(96.11,78.26)
PB5: length 294.8
  Top Layer w0.381: v1(77.5,280.85) v1(77.5,94.08)
  Bottom Layer w0.381: 84.43,282.19 78.84,282.19 v1(77.5,280.85) ; v1(77.5,94.08) 78.44,94.08 134.42,38.1 143.46,38.1 CN3.11
PB6: length 282
  Top Layer w0.381: v1(78.84,91.13) v1(78.84,279.7)
  Bottom Layer w0.381: v1(78.84,91.13) 79.43,91.13 134.21,36.35 135.05,36.35 CN3.13 ; 84.43,279.65 78.89,279.65 v1(78.84,279.7)
PB7: length 262.8
  Top Layer w0.381: v1(82.75,85.75) 82.75,270.36 84.43,272.03
  Bottom Layer w0.381: CN3.15 131.22,37.29 v1(82.75,85.75)
PB8: length 274.8
  Top Layer w0.381: U12.2 123.67,272.03 126.42,269.29 126.42,83.01 132.66,76.76 187.73,76.76 CN4.1
PB9: length 271.4
  Top Layer w0.381: v1(176.33,78.1) 133.4,78.1 130.4,81.1 130.4,273.3 124.05,279.65 U12.5
  Bottom Layer w0.381: v1(176.33,78.1) 192.18,62.26 CN4.3
PB10: length 261.9
  Top Layer w0.381: v1(163.27,79.45) 163.25,79.48 134.57,79.48 131.93,82.12 131.93,273.81 U12.6
  Bottom Layer w0.381: v1(163.27,79.45) 164.72,79.45 CN4.5
PB11: length 258
  Top Layer w0.381: U12.9 133.44,279.92 133.44,82.99 135.61,80.82 v1(153.21,80.82)
  Bottom Layer w0.381: v1(153.21,80.82) 153.21,80.8 CN4.7
PB12: length 269.3
  Top Layer w0.381: U12.12 114.58,289.81 109.83,285.06 109.83,87.76 125.25,72.34 154.03,72.34 161.7,64.67 CN4.9
PB13: length 248.8
  Top Layer w0.381: U12.15 113,282.19 111.05,280.24 111.05,88.54 125.96,73.63 v1(140.06,73.63)
  Bottom Layer w0.381: v1(140.06,73.63) CN4.11
PB14: length 234
  Top Layer w0.381: v1(128.78,74.9) 126.54,74.9 112.32,89.13 112.32,278.82 113.16,279.65 U12.16
  Bottom Layer w0.381: CN4.13 141.38,62.31 v1(128.78,74.9)
PB15: length 217.9
  Top Layer w0.381: v1(125.92,77.3) 125.92,77.79 113.84,89.86 113.84,269.93 115.93,272.01 U12.19
  Bottom Layer w0.381: CN4.15 125.92,67.45 v1(125.92,77.3)
PBWR: length 159.3
  Top Layer w0.381: U5.10 188.8,342.54 187.58,341.32 v1(187.58,297.36)
  Bottom Layer w0.381: 84.43,292.35 84.43,293.98 87.1,296.65 114.38,296.65 115.93,295.1 U12.11 119.71,296.14 186.36,296.14 v1(187.58,297.36)
START: length 76.1
  Top Layer w0.381: U6.11 217.43,340.29 216.53,339.39 216.53,318.01 v1(217.96,316.59) ; v1(240.34,316.59) 249.83,307.09 249.83,298.09 251.54,296.39 254.33,296.39 254.51,296.21
  Bottom Layer w0.381: v1(240.34,316.59) v1(217.96,316.59)
STRT: length 98.6
  Top Layer w0.381: v1(235.06,357.17) 235.06,340.66 R3.1 233.17,339.06 230.2,336.09 v1(230.2,329.89)
  Bottom Layer w0.381: U6.12 222.81,333.58 222.81,331.42 224.33,329.89 v1(230.2,329.89) ; 280.06,373.71 280.16,373.61 280.16,371.96 265.4,357.2 235.34,357.2 235.31,357.17 v1(235.06,357.17)
$1N4042: length 44.1
  Top Layer w0.381: v1(197.05,328.42) 197.05,334.04 197.94,334.92 U5.2 ; v1(169.16,328.42) 169.16,333.86 170.34,335.03 U4.2
  Bottom Layer w0.381: v1(169.16,328.42) v1(197.05,328.42)
$1N4048: length 61.6
  Top Layer w0.381: U5.4 200.76,340 201.98,338.78 v1(201.98,326.87) ; v1(183.54,342.59) v1(183.54,326.95)
  Bottom Layer w0.381: v1(201.98,326.87) 201.9,326.95 v1(183.54,326.95) ; v1(183.54,342.59) 183.49,342.65 U4.5
$1N4055: length 46.1
  Top Layer w0.381: v1(181.82,345.19) 190.12,353.49 202.59,353.49 202.77,353.31 202.77,346.36 201.45,345.03 199.09,345.03 U5.6
  Bottom Layer w0.381: U4.6 v1(181.82,345.19)
$1N4893: length 32.5
  Bottom Layer w0.381: 226.26,342.75 227.54,342.75 233.07,348.28 241.21,348.28 R5.2 245.3,344.2 252.55,344.2 C3.2
$1N4905: length 47
  Bottom Layer w0.381: C1.2 253.95,338.96 252.07,340.84 245.74,340.84 R3.2 243.96,337.46 234.72,328.22 223.09,328.22 221.31,330 221.31,332.87 218.97,335.21 U6.13
$1N5385: length 30.5
  Top Layer w0.381: R4.2 241.26,335.23 v1(238.91,335.23)
  Bottom Layer w0.381: U6.2 226.29,335.23 v1(238.91,335.23) ; C2.2 252.35,334.24 245.66,334.24 R4.2
$1N5398: length 167.9
  Top Layer w0.381: v1(106.25,358.19) 106.25,340.44 108.04,338.64 U7.13 ; v1(218.62,357.58) 218.62,347.93 U6.8 219.35,347.91 220.6,346.66 220.6,343.99 219.43,342.83 U6.10
  Bottom Layer w0.381: U6.10 221.11,342.83 223.65,345.36 226.26,345.36 U6.6 ; v1(218.62,357.58) 218.01,358.19 v1(106.25,358.19) ; U7.13 U7.4
$1N5648: length 39.3
  Bottom Layer w0.381: U8.1 143.84,331.02 143.84,329.19 141.68,327.02 112.62,327.02 109.44,330.21 U7.16
$1N5652: length 38.5
  Bottom Layer w0.381: U7.15 109.77,333.56 114.68,328.65 136.86,328.65 141.69,333.48 143.76,333.48 U8.2
$1N5656: length 56
  Top Layer w0.381: v1(138.94,355.73) 138.94,339.5 v1(138.96,339.47)
  Bottom Layer w0.381: v1(138.96,339.47) 142.34,336.09 143.83,336.09 U8.3 ; U7.10 110.37,346.26 119.81,355.7 138.91,355.7 v1(138.94,355.73)
$1N5992: length 111.7
  Top Layer w0.381: v1(228.8,353.77) 228.8,339.37 227.18,337.75 U6.3 ; v1(147.57,353.87) 147.57,345.57 145.69,343.69 145.44,343.69 145.41,343.72 U8.6
  Bottom Layer w0.381: v1(228.8,353.77) 228.7,353.87 v1(147.57,353.87)
$1N6878: length 55.6
  Bottom Layer w0.381: U8.7 144.48,346.26 149.4,351.18 182.78,351.18 188.72,345.24 188.72,342.32 U5.11
$1N6889: length 61.7
  Top Layer w0.381: v1(136.22,352.58) U8.9
  Bottom Layer w0.381: U5.9 183.55,352.58 v1(136.22,352.58)
$1N11000: length 65.3
  Top Layer w0.381: U4.8 161.34,345.49 v1(161.34,340.41)
  Bottom Layer w0.381: U5.13 191.03,334.92 190.97,334.92 190.89,334.84 189.77,334.84 187.05,337.57 187.05,344.93 182.23,349.75 166.27,349.75 164.55,348.03 163.84,348.03 163.58,347.77 U4.8 ; U8.4 148.04,338.64 149.81,340.41 v1(161.34,340.41)
$2N957: length 7.8
  Top Layer w0.381: U13.24 248.04,91.06
$2N968: length 7.8
  Top Layer w0.381: U14.24 U14.1
$2N978: length 7.8
  Top Layer w0.381: 330.9,91.06 338.7,91.06
$2N1093: length 37.7
  Top Layer w0.381: R6.1 255.12,89.06 248.04,96.14
$2N1103: length 36.7
  Top Layer w0.381: R8.1 293.73,95.83 293.42,96.14 U14.3
$2N1109: length 40.9
  Top Layer w0.381: R9.1 277.9,94.9 281.69,98.68 U14.21
$2N1124: length 43
  Top Layer w0.381: 338.7,96.14 341.02,96.14 341.15,96.01 341.15,75.51 R10.1
$2N1478: length 22.6
  Top Layer w0.381: 257.53,37.21 260.07,37.21 260.07,28.41 J1.3
$2N1570: length 21.9
  Top Layer w0.381: J3.3 295.15,26.55 295.15,37.21 292.61,37.21
$2N1577: length 22.7
  Top Layer w0.381: J5.3 326.47,28.59 326.47,37.21 323.93,37.21
$2N1586: length 31.3
  Top Layer w0.381: U17.6 U17.7 284.68,34.37 J4.3
$2N1601: length 30.5
  Top Layer w0.381: U18.6 U18.7 317.91,36.27 317.91,20.46 J6.3
$2N1963: length 41
  Top Layer w0.381: U13.21 238.1,98.68 237.39,97.97 237.39,63.88 239.88,61.39 R7.1
$2N2005: length 46
  Top Layer w0.381: R11.1 313.39,73.28 327.18,87.07 327.18,97.43 328.42,98.68 330.9,98.68
$2N2011: length 28
  Top Layer w0.381: 265.48,61.26 265.18,60.96 265.18,58.47 264.21,57.51 264.21,54.11 C4.2 267.44,50.77 267.44,43.48 262.61,38.66 262.61,37.21
$2N2015: length 29
  Top Layer w0.381: R7.2 250.14,58.67 249.33,57.86 249.33,54.11 C5.2 249.27,51.34 250.98,49.63 260.35,49.63 U16.5
$2N2020: length 26.7
  Top Layer w0.381: R8.2 303.76,61.36 303.76,58.8 302.51,57.56 302.51,54.06 C6.2 302.5,44.06 297.69,39.24 297.69,37.21
$2N2025: length 24.9
  Top Layer w0.381: R9.2 287.9,58.67 287.15,57.91 287.15,54.11 C7.2 292.83,48.31 297.18,48.31 300.23,45.26 U17.5
$2N2030: length 27.5
  Top Layer w0.381: R10.2 337.03,58.87 335.86,57.71 335.86,54.26 335.86,54.25 C8.2 335.86,44.26 329.01,37.41 329.01,37.21
$2N2035: length 22.3
  Top Layer w0.381: R11.2 323.39,58.92 322.32,57.85 C9.2 326.08,50.29 328.65,50.29 331.55,47.4 U18.5
$2N2404: length 30.5
  Top Layer w0.381: J2.3 251.41,35.15 260.07,43.81 U16.7 U16.6
$2N2987: length 10.5
  Top Layer w0.381: C10.2 242.54,294.56 R12.1 246.81,293.6 246.89,293.67
$2N2991: length 15.3
  Top Layer w0.381: U19.11 246.84,298.7 244.09,298.7 242.08,300.72 C10.1
$2N3069: length 11
  Bottom Layer w0.381: VR1.3 237.57,286.4 237.57,290.5 234.47,293.6 R12.2
$2N3148: length 39.3
  Top Layer w0.381: U20.3 U20.4 255.73,270.36 257.45,272.08 257.45,300.89 U19.6
$2N3319: length 12.5
  Bottom Layer w0.381: R13.2 236.25,265.33 237.52,264.05 VR2.3
$2N3321: length 18.8
  Top Layer w0.381: U20.13 246.74,265.33 R13.1
  Bottom Layer w0.381: 232.48,273.08 232.48,270.92 236.22,267.18 240.68,267.18 R13.1
$2N3323: length 8
  Top Layer w0.381: C11.1 246.56,270.58 U20.11
$2N3386: length 27.2
  Top Layer w0.381: 247.78,253.8 247.78,256.44 249.56,258.22 249.56,277.11 248.69,277.98 U20.8
$2N3394: length 23.2
  Top Layer w0.381: U20.6 251.71,272.75 251.71,258.22 252.86,257.07 H1.3
$2N3813: length 333.3
  Top Layer w0.381: v1(343.08,242.9) 362.31,223.67 362.31,26 J7.3 ; v1(255.68,242.9) 250.32,248.26 H1.2
  Bottom Layer w0.381: v1(255.68,242.9) v1(343.08,242.9)

## Copper pours and planes (outline as drawn; the poured copper is in the pictures)
GND on Top Layer: 169.49,381.2 171.32,381.2 171.32,373.07 169.49,373.07
GND on Top Layer: 13.92,381.2 15.75,381.2 15.75,373.07 13.92,373.07
GND on Bottom Layer: 223.6,107.39 366.88,107.39 366.88,2.69 223.6,2.69
GND on Bottom Layer: 358.57,381.2 360.4,381.2 360.4,373.07 358.57,373.07
VCC on Top Layer: 166.32,381.2 168.15,381.2 168.15,373.07 166.32,373.07
VCC on Top Layer: 17.09,381.2 18.92,381.2 18.92,373.07 17.09,373.07
VDD on Bottom Layer: 345.87,381.2 347.7,381.2 347.7,373.07 345.87,373.07
(no net) on Top Layer: 244.27,381.2 246.1,381.2 246.1,373.07 244.27,373.07
(no net) on Top Layer: 45.67,381.2 47.5,381.2 47.5,373.07 45.67,373.07
(no net) on Top Layer: 247.45,381.2 249.28,381.2 249.28,373.07 247.45,373.07
(no net) on Top Layer: 225.22,381.2 227.05,381.2 227.05,373.07 225.22,373.07
(no net) on Top Layer: 228.4,381.2 230.23,381.2 230.23,373.07 228.4,373.07
(no net) on Top Layer: 93.29,381.2 95.12,381.2 95.12,373.07 93.29,373.07
(no net) on Top Layer: 206.17,381.2 208,381.2 208,373.07 206.17,373.07
(no net) on Top Layer: 276.02,381.2 277.85,381.2 277.85,373.07 276.02,373.07
(no net) on Top Layer: 352.22,381.2 354.05,381.2 354.05,373.07 352.22,373.07
(no net) on Top Layer: 61.54,381.2 63.37,381.2 63.37,373.07 61.54,373.07
(no net) on Top Layer: 36.14,381.2 37.97,381.2 37.97,373.07 36.14,373.07
(no net) on Top Layer: 58.37,381.2 60.2,381.2 60.2,373.07 58.37,373.07
(no net) on Top Layer: 48.84,381.2 50.67,381.2 50.67,373.07 48.84,373.07
(no net) on Top Layer: 222.05,381.2 223.88,381.2 223.88,373.07 222.05,373.07
(no net) on Top Layer: 250.62,381.2 252.45,381.2 252.45,373.07 250.62,373.07
(no net) on Top Layer: 234.75,381.2 236.58,381.2 236.58,373.07 234.75,373.07
(no net) on Top Layer: 237.92,381.2 239.75,381.2 239.75,373.07 237.92,373.07
(no net) on Top Layer: 288.72,381.2 290.55,381.2 290.55,373.07 288.72,373.07
(no net) on Top Layer: 279.2,381.2 281.03,381.2 281.03,373.07 279.2,373.07
(no net) on Top Layer: 109.17,381.2 111,381.2 111,373.07 109.17,373.07
(no net) on Top Layer: 218.87,381.2 220.7,381.2 220.7,373.07 218.87,373.07
(no net) on Top Layer: 323.65,381.2 325.48,381.2 325.48,373.07 323.65,373.07
(no net) on Top Layer: 320.47,381.2 322.3,381.2 322.3,373.07 320.47,373.07
(no net) on Top Layer: 150.44,381.2 152.27,381.2 152.27,373.07 150.44,373.07
(no net) on Top Layer: 241.1,381.2 242.93,381.2 242.93,373.07 241.1,373.07
(no net) on Top Layer: 42.49,381.2 44.32,381.2 44.32,373.07 42.49,373.07
(no net) on Top Layer: 345.87,381.2 347.7,381.2 347.7,373.07 345.87,373.07
(no net) on Top Layer: 215.7,381.2 217.53,381.2 217.53,373.07 215.7,373.07
(no net) on Top Layer: 231.57,381.2 233.4,381.2 233.4,373.07 231.57,373.07
(no net) on Top Layer: 326.82,381.2 328.65,381.2 328.65,373.07 326.82,373.07
(no net) on Top Layer: 144.09,381.2 145.92,381.2 145.92,373.07 144.09,373.07
(no net) on Top Layer: 295.07,381.2 296.9,381.2 296.9,373.07 295.07,373.07
(no net) on Top Layer: 263.32,381.2 265.15,381.2 265.15,373.07 263.32,373.07
(no net) on Top Layer: 212.52,381.2 214.35,381.2 214.35,373.07 212.52,373.07
(no net) on Top Layer: 118.69,381.2 120.52,381.2 120.52,373.07 118.69,373.07
